# Altium schematic sheet LCD_Character_2x16.SchDoc
size A4
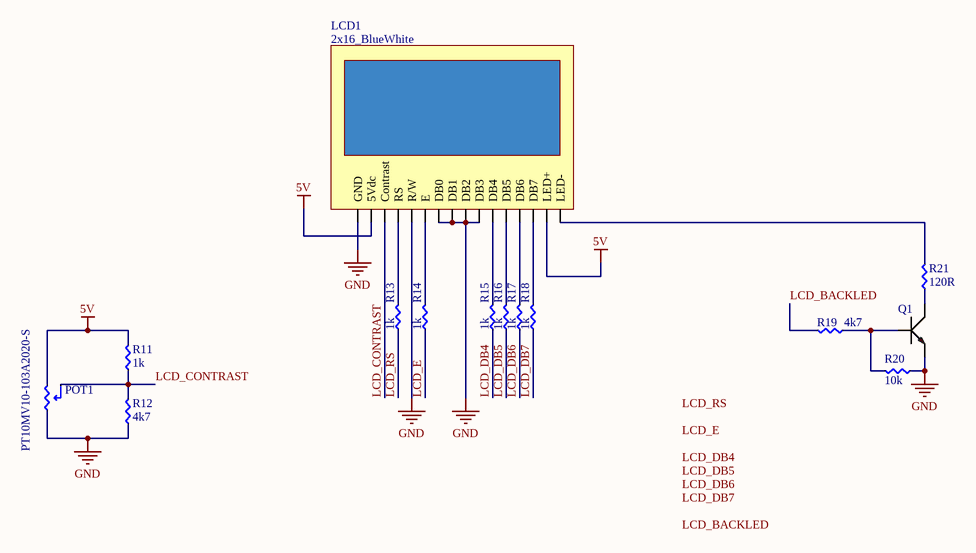
[diagram p0: LCD_Character_2x16.SchDoc]

## Parts
LCD1  2x16_BlueWhite  [LCD_2x16_8.4mm]
POT1  PT10MV10-103A2020-S  [pot_piher_v10]
Q1  BC817-25LT1G  [SOT-23]  (value not drawn)
R11  1k  [R_0805]
R12  4k7  [R_0805]
R13  1k  [R_0805]
R14  1k  [R_0805]
R15  1k  [R_0805]
R16  1k  [R_0805]
R17  1k  [R_0805]
R18  1k  [R_0805]
R19  4k7  [R_0805]
R20  10k  [R_0805]
R21  120R  [R_0805]

## Nets
5V: LCD1.2(5Vdc) LCD1.15(LED+) POT1.2 R11.2
GND: LCD1.1(GND) LCD1.5(R/W) LCD1.7(DB0) LCD1.8(DB1) LCD1.9(DB2) LCD1.10(DB3) POT1.1 Q1.3(Emiter) R12.1 R20.1
LCD_BACKLED: R19.2
LCD_CONTRAST: LCD1.3(Contrast) POT1.3 R11.1 R12.2
LCD_DB4: R15.1
LCD_DB5: R16.1
LCD_DB6: R17.1
LCD_DB7: R18.1
LCD_E: R14.1
LCD_RS: R13.1
NetLCD1_4: LCD1.4(RS) R13.2
NetLCD1_6: LCD1.6(E) R14.2
NetLCD1_11: LCD1.11(DB4) R15.2
NetLCD1_12: LCD1.12(DB5) R16.2
NetLCD1_13: LCD1.13(DB6) R17.2
NetLCD1_14: LCD1.14(DB7) R18.2
NetLCD1_16: LCD1.16(LED-) R21.2
NetQ1_1: Q1.1(Collector) R21.1
NetQ1_2: Q1.2(Base) R19.1 R20.2

## Notes on the sheet
- Labels drawn without touching a wire or pin: LCD_BACKLED, LCD_DB4, LCD_DB5, LCD_DB6, LCD_DB7, LCD_E, LCD_RS

## Library data of the parts
LCD1 = NHD-0216K1Z-NSW-BBW-L: LCD MOD CHAR 2X16 WHT TRANSM; Manufacturer: Newhaven Display; Backlight Type: LED; Operating Supply Voltage: 5V; Interface: Parallel; Number of Characters: 32; Background Color: Blue; Contrast Ratio: 3:1; Supplier 1: Digi-Key; Manufacturer Part Number: NHD-0216K1Z-NSW-BBW-L; Stock 1: 4395; Pricing 1: 1 = 12,43000, 5 = 11,68800, 10 = 10,94200, 50 = 10,32000, 100 = 9,82260, 250 = 9,32524, 500 = 8,95222 (USD); RoHS: Yes; Mount: Screw; Number of Pins: 16; Min Operating Temperature: -20°C; Max Operating Temperature: 70°C; Package Quantity: 50; Packaging: Bulk; ComponentLink1URL: https://datasheet.ciiva.com/19454/2118598-19454067.pdf?src-supplier=Jameco; ComponentLink1Description: https://datasheet.ciiva.com/19454/2118598-19454067.pdf?src-supplier=Jameco; ComponentLink2URL: https://datasheet.ciiva.com/2102/nhd-0216k1z-nsw-bbw-l-2102246.pdf?src-supplier=Digi-Key; ComponentLink2Description: https://datasheet.ciiva.com/2102/nhd-0216k1z-nsw-bbw-l-2102246.pdf?src-supplier=Digi-Key; ComponentLink3URL: https://datasheet.ciiva.com/5325/nhd-0216k1z-nsw-bbw-l-35602-5325807.pdf?src-supplier=Mouser; ComponentLink3Description: https://datasheet.ciiva.com/5325/nhd-0216k1z-nsw-bbw-l-35602-5325807.pdf?src-supplier=Mouser; ComponentLink4URL: https://datasheet.ciiva.com/49271/70518091-49271829.pdf?src-supplier=Allied+Electronics; ComponentLink4Description: https://datasheet.ciiva.com/49271/70518091-49271829.pdf?src-supplier=Allied+Electronics; ComponentLink5URL: https://datasheet.ciiva.com/16231/nhd-0216k1z-nsw-bbw-l-16231594.pdf?src-supplier=Onlinecomponents.com; ComponentLink5Description: https://datasheet.ciiva.com/16231/nhd-0216k1z-nsw-bbw-l-16231594.pdf?src-supplier=Onlinecomponents.com; ComponentLink6URL: https://datasheet.ciiva.com/30085/nhd-0216k1z-nsw-bbw-l-30085308.pdf?src-supplier=Onlinecomponents.com; ComponentLink6Description: https://datasheet.ciiva.com/30085/nhd-0216k1z-nsw-bbw-l-30085308.pdf?src-supplier=Onlinecomponents.com; Supplier Part Number 1: NHD-0216K1Z-NSW-BBW-L-ND
POT1 = PT10MV10-103A2020-S: POT 10K OHM LINEAR; Manufacturer 1: Piher; Number of Gangs: 1; Supplier 1: Digi-Key; Manufacturer Part Number 1: PT10MV10-103A2020-S; Description 1: POT 10K OHM LINEAR; Stock 1: 4792; Pricing 1: 1=0.46, 10=0.427, 25=0.3812, 50=0.3682, 100=0.3419, 250=0.33532, 500=0.30902, 1000=0.263, 5000=0.21698 (USD); Mount: Through Hole; Packaging: Bulk; Termination: Pin; Number of Turns: 1; ComponentLink1URL: http://www.mouser.com/ds/2/325/12-PT10v03-6148.pdf?src-supplier=Mouser; ComponentLink1Description: http://www.mouser.com/ds/2/325/12-PT10v03-6148.pdf?src-supplier=Mouser; Supplier Part Number 1: 1993-1104-ND
Q1 = BC817-25LT1G: TRANS NPN 45V 0.5A SOT23; Manufacturer: ON Semiconductor; Vce Saturation (Max) @ Ib, Ic: 700mV @ 50mA, 500mA; Current - Collector Cutoff (Max): 100nA (ICBO); DC Current Gain (hFE) (Min) @ Ic, Vce: 160 @ 100mA, 1V; Frequency - Transition: 100MHz; Supplier 1: Digi-Key; Manufacturer Part Number: BC817-25LT1G; RoHS: RoHS Compliant; Category: Discrete Semiconductor Products; Stock 1: 49597; Pricing 1: 1=0.2, 10=0.185, 100=0.101, 500=0.06214, 1000=0.04237 (USD); Packaging: Cut Tape (CT); Part Status: Active; Transistor Type: NPN; Operating Temperature: -65°C ~ 150°C (TJ); Mounting Type: Surface Mount; Package / Case: TO-236-3, SC-59, SOT-23-3; Supplier Device Package: SOT-23-3 (TO-236); Base Part Number: BC817; ComponentLink1URL: http://www.onsemi.com/pub/Collateral/BC817-16LT1-D.PDF; ComponentLink1Description: http://www.onsemi.com/pub/Collateral/BC817-16LT1-D.PDF; Supplier Part Number 1: BC817-25LT1GOSCT-ND
R11 R13-R18 = RC0805JR-071KL: RES SMD 1K OHM 5% 1/8W 0805; Manufacturer 1: Yageo; Resistance: 1kR; Power Rating: 125mW; Voltage Rating: 150V; Temperature Coefficient: 100ppm/°C; Supplier 1: Digi-Key; Manufacturer Part Number 1: RC0805JR-071KL; Stock 1: 7274635; Pricing 1: 1=0.1, 10=0.036, 100=0.0146, 1000=0.00654, 2500=0.00568 (USD); Case/Package: 0805; Case Code (Imperial): 0805; Case Code (Metric): 2012; Contact Plating: Tin,Lead,Matte; Min Operating Temperature: -55°C; Max Operating Temperature: 155°C; Tolerance: 5%; Packaging: Tape and Reel; Termination: SMD/SMT; Composition: Thick Film; Military Standard: Not; Length: 2mm; Depth: 1.25mm; Radiation Hardening: No; REACH SVHC: Unknown; Lead Free: Lead Free; ComponentLink1URL: http://www.farnell.com/datasheets/2167052.pdf?src-supplier=Verical; ComponentLink1Description: http://www.farnell.com/datasheets/2167052.pdf?src-supplier=Verical; ComponentLink2URL: http://www.farnell.com/datasheets/2167052.pdf?src-supplier=Mouser; ComponentLink2Description: http://www.farnell.com/datasheets/2167052.pdf?src-supplier=Mouser; ComponentLink3URL: http://www.farnell.com/datasheets/442941.pdf?src-supplier=Element14; ComponentLink3Description: http://www.farnell.com/datasheets/442941.pdf?src-supplier=Element14; ComponentLink4URL: http://www.farnell.com/datasheets/444164.pdf?src-supplier=Element14; ComponentLink4Description: http://www.farnell.com/datasheets/444164.pdf?src-supplier=Element14; Supplier Part Number 1: 311-1.0KARCT-ND
R12 R19 = RC0805JR-074K7L: RES SMD 4.7K OHM 5% 1/8W 0805; Manufacturer: Yageo; Resistance: 4.7kR; Temperature Coefficient: 100ppm/°C; Power Rating: 125mW; Voltage Rating: 150V; Supplier 1: Digi-Key; Manufacturer Part Number: RC0805JR-074K7L; Stock 1: 4531065; Pricing 1: 1=0.1, 10=0.036, 100=0.0146, 1000=0.00654, 2500=0.00568 (USD); Case/Package: Molded; Contact Plating: Lead,Matte,Tin; Case Code (Imperial): 0805; Case Code (Metric): 2012; Min Operating Temperature: -55°C; Max Operating Temperature: 155°C; Tolerance: 5%; Composition: Thick Film; Packaging: Tape and Reel; Termination: SMD/SMT; Military Standard: Not; Length: 2mm; Depth: 1.25mm; Radiation Hardening: No; REACH SVHC: Unknown; Lead Free: Lead Free; ComponentLink1URL: http://www.farnell.com/datasheets/442941.pdf?src-supplier=Element14; ComponentLink1Description: http://www.farnell.com/datasheets/442941.pdf?src-supplier=Element14; ComponentLink2URL: http://www.yageo.ru/pdf/RC0805.pdf?src-supplier=Future+Electronics; ComponentLink2Description: http://www.yageo.ru/pdf/RC0805.pdf?src-supplier=Future+Electronics; ComponentLink3URL: http://www.mouser.com/ds/2/447/Yageo_08112016_RC0805-968729.pdf?src-supplier=Mouser; ComponentLink3Description: http://www.mouser.com/ds/2/447/Yageo_08112016_RC0805-968729.pdf?src-supplier=Mouser; Supplier Part Number 1: 311-4.7KARDKR-ND
R20 = RC0805JR-0710KL: RES SMD 10K OHM 5% 1/8W 0805; Manufacturer 1: Yageo; Resistance: 10kR; Power Rating: 125mW; Voltage Rating: 150V; Temperature Coefficient: 100ppm/°C; Supplier 1: Digi-Key; Manufacturer Part Number 1: RC0805JR-0710KL; Description 1: RES SMD 10K OHM 5% 1/8W 0805; Stock 1: 14124104; Pricing 1: 1=0.1, 10=0.036, 100=0.0146, 1000=0.00654, 2500=0.00568 (USD); Case/Package: 0805; Case Code (Imperial): 0805; Case Code (Metric): 2012; Contact Plating: Tin,Matte; Min Operating Temperature: -55°C; Max Operating Temperature: 155°C; Tolerance: 5%; Packaging: Tape and Reel; Termination: SMD/SMT; Composition: Thick Film; Military Standard: Not; Length: 2mm; Height: 0.5mm; Depth: 1.25mm; Width: 1.25mm; Radiation Hardening: No; REACH SVHC: Unknown; Lead Free: Lead Free; ComponentLink1URL: http://www.farnell.com/datasheets/444164.pdf?src-supplier=Element14; ComponentLink1Description: http://www.farnell.com/datasheets/444164.pdf?src-supplier=Element14; Supplier Part Number 1: 311-10KARCT-ND
R21 = RC0805FR-07120RL: RES SMD 120 OHM 1% 1/8W 0805; Manufacturer: Yageo; Power Rating: 125mW; Voltage Rating: 150V; Temperature Coefficient: 100ppm/°C; Supplier 1: Digi-Key; Manufacturer Part Number: RC0805FR-07120RL; Stock 1: 326738; Pricing 1: 1 = 0,10000, 10 = 0,03600, 100 = 0,01480, 1000 = 0,00665, 2500 = 0,00577 (USD); RoHS: Yes; Case/Package: 0805; Case Code (Metric): 2012; Case Code (Imperial): 0805; Min Operating Temperature: -55°C; Max Operating Temperature: 155°C; Resistance: 120R; Tolerance: 1%; Package Quantity: 1; Packaging: Tape and Reel; Resistor Type: Thick Film; Number of Terminations: 2; Termination: SMD/SMT; Max Power Dissipation: 125mW; Features: Moisture Resistant; Length: 2mm; Width: 0.049inch; Height: 0.5mm; Depth: 1.25mm; REACH SVHC: Unknown; Military Standard: Not; Lead Free: Lead Free; ComponentLink1URL: https://datasheet.ciiva.com/11819/0900766b8106beab-11819786.pdf?src-supplier=RSComponents; ComponentLink1Description: https://datasheet.ciiva.com/11819/0900766b8106beab-11819786.pdf?src-supplier=RSComponents; ComponentLink2URL: https://datasheet.ciiva.com/2491/pyu-r-int-thick-7-2491585.pdf?src-supplier=Digi-Key; ComponentLink2Description: https://datasheet.ciiva.com/2491/pyu-r-int-thick-7-2491585.pdf?src-supplier=Digi-Key; ComponentLink3URL: https://datasheet.ciiva.com/2491/pyu-r-int-thick-7-2491586.pdf?src-supplier=Digi-Key; ComponentLink3Description: https://datasheet.ciiva.com/2491/pyu-r-int-thick-7-2491586.pdf?src-supplier=Digi-Key; ComponentLink4URL: https://datasheet.ciiva.com/2491/pyu-r-int-thick-7-2491587.pdf?src-supplier=Digi-Key; ComponentLink4Description: https://datasheet.ciiva.com/2491/pyu-r-int-thick-7-2491587.pdf?src-supplier=Digi-Key; ComponentLink5URL: https://datasheet.ciiva.com/12558/rc0805-257173-12558661.pdf?src-supplier=Mouser; ComponentLink5Description: https://datasheet.ciiva.com/12558/rc0805-257173-12558661.pdf?src-supplier=Mouser; ComponentLink6URL: https://datasheet.ciiva.com/7941/444164-7941691.pdf?src-supplier=Element14; ComponentLink6Description: https://datasheet.ciiva.com/7941/444164-7941691.pdf?src-supplier=Element14; ComponentLink7URL: https://datasheet.ciiva.com/7941/444164-7941692.pdf?src-supplier=Element14; ComponentLink7Description: https://datasheet.ciiva.com/7941/444164-7941692.pdf?src-supplier=Element14; ComponentLink8URL: https://datasheet.ciiva.com/16964/rc0805-16964606.pdf?src-supplier=Future+Electronics; ComponentLink8Description: https://datasheet.ciiva.com/16964/rc0805-16964606.pdf?src-supplier=Future+Electronics; Supplier Part Number 1: 311-120CRCT-ND